# Altium schematic sheet Current_Sense.SchDoc
size 127 x 101 mm; SheetNumber: 2; SheetTotal: 7
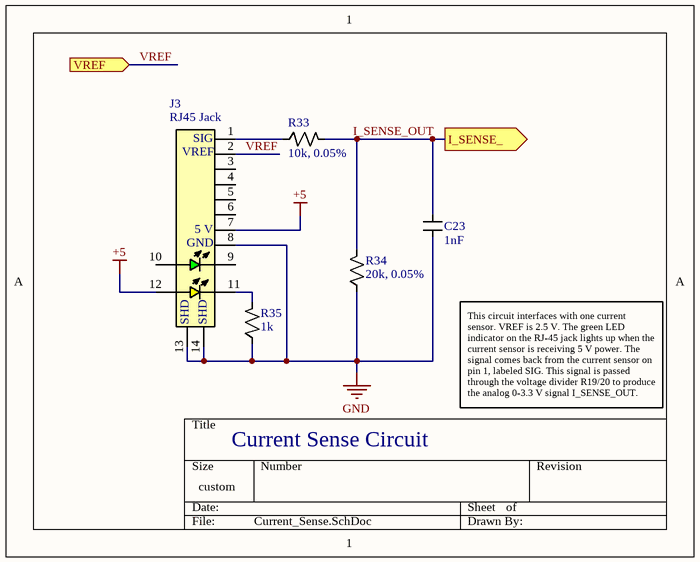
[diagram p0: Current_Sense.SchDoc]

## Parts
C23  1nF  [0603_CAP]
J3  RJ45 Jack  [RJ45_JACK]
R33  10k, 0.05%  [0603_RES]
R34  20k, 0.05%  [0603_RES]
R35  1k  [0603_RES]

## Ports
I_SENSE_ (out, see Load_Bank_Master[3D]), VREF (in, see Load_Bank_Master[2D])

## Nets
+5: J3.7(12_V) J3.12
GND: C23.1 J3.8(GND) J3.13(SHD1) J3.14(SHD2) R34.1 R35.1
I_SENSE_OUT: C23.2 R33.2 R34.2 ; port I_SENSE_
VREF: J3.2(VREF) ; port VREF
NetJ3_1: J3.1(Sig1) R33.1
NetJ3_11: J3.11 R35.2

Not connected (* = marked no-connect by the designer): J3 3(NC) 4(NC) 5(NC) 6(NC) 9(__) 10(__)

## Notes on the sheet
- Current Sense Circuit
- This circuit interfaces with one current sensor. VREF is 2.5 V. The green LED indicator on the RJ-45 jack lights up when the current sensor is receiving 5 V power. The signal comes back from the current sensor on pin 1, labeled SIG. This signal is passed through the voltage divider R19/20 to produce the analog 0-3.3 V signal I_SENSE_OUT.
- (in symbol J_RJ45_Jack_Sense) SIG; 5 V; SHD

## Library data of the parts
C23 = C_1nF_0603: Capacitor SMD MLCC 1 nF 0603
J3 = J_RJ45_Jack_Sense: Jack RJ-45 8-pin (for current sensing)
R33 = R_10kOhm_0603_0.05%: Resistor 10 kOhm 0603 0.05%
R34 = R_20kOhm_0603_0.05%: Resistor 20 kOhm 0603 0.05%
R35 = R_1kOhm_0603_0.5%: Resistor 1 kOhm 0603 0.5%